# EAGLE schematic Discrete Datalogger ECU rev2 (EAGLE 8.6.0)
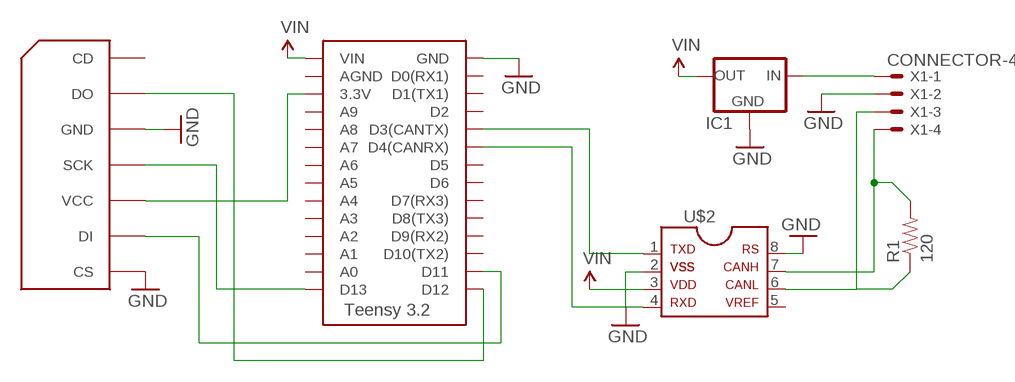
[diagram p0: schematic, sheet 1]

## Parts
IC1  5VREG_L7805_VERT  [TO-220]
R1  120  RESISTORAXIAL-0.3  [AXIAL-0.3]
U$1  TEENSY_3.2_SIMPLE  [TEENSY_3.2_SIMPLE]
U$2  MCP2551DIL  [DIL08]
U$3  SDCARD_INTERFACE  [SDCARD_INTERFACE]
X1  CONNECTOR-4  [MINIFIT_5566-4]

## Nets
12V: IC1.1(IN) X1.1
CANH: R1.P$2 U$2.7 X1.4
CANL: R1.P$1 U$2.6 X1.3
GND: IC1.2(GND) U$1.GND U$2.2 U$2.8 U$3.CS U$3.GND X1.2
N$4: U$1.D3(CANTX) U$2.1
N$5: U$1.D4(CANRX) U$2.4
N$6: U$1.D13 U$3.SCK
N$7: U$1.D11 U$3.DI
N$8: U$1.3.3V U$3.VCC
N$9: U$1.D12 U$3.DO
VIN: IC1.3(OUT) U$1.VIN U$2.3
Unconnected: U$1.A0 U$1.A1 U$1.A2 U$1.A3 U$1.A4 U$1.A5 U$1.A6 U$1.A7 U$1.A8 U$1.A9 U$1.AGND U$1.D0(RX1) U$1.D1(TX1) U$1.D2 U$1.D5 U$1.D6 U$1.D7(RX3) U$1.D8(TX3) U$1.D9(RX2) U$1.D10(TX2) U$2.5 U$3.CD

## Library data of the parts
IC1 = HyTechDevices:5VREG_L7805: Voltage Regulator Switching 5v regulator Datasheet <http://power.murata.com/data/power/oki-78sr.pdf> Standard 7805 5V regulator. IGO (Input Ground Output). Spark Fun Electronics SKU : COM-00107 Datasheet <http://www.mouser.com/ds/2/308/MC7800-D-94905.pdf>
R1 = HyTechDevices:RESISTOR: Resistor Basic schematic elements and footprints for 0603, 1206, and PTH resistors.
U$1 = HyTechDevices:TEENSY_3.2_SIMPLE: Simple version of the Teensy 3.2 board that only uses the 2 main rows of pins, not the inner pins or the pins opposite the usb port.
U$2 = HyTechDevices:MCP2551: MCP2551 High-Speed CAN Transceiver Product Webpage <https://www.microchip.com/wwwproducts/en/MCP2551> Datasheet <http://ww1.microchip.com/downloads/en/DeviceDoc/21667f.pdf> This device is outdated It is replaced by MCP2561. Comparison Page <https://www.microchip.com/wwwproducts/ProductCompare/MCP2551/MCP2561> Product Webpage <https://www.microchip.com/wwwproducts/en/MCP2561> Datasheet <http://ww1.microchip.com/downloads/en/DeviceDoc/20005167C.pdf>
U$3 = HyTechDevices:SDCARD_INTERFACE
X1 = HyTechDevices:CONNECTOR-4: Mini-Fit Junior connector 4 pole Source: http://www.molex.com; OC_FARNELL: unknown; OC_NEWARK: unknown